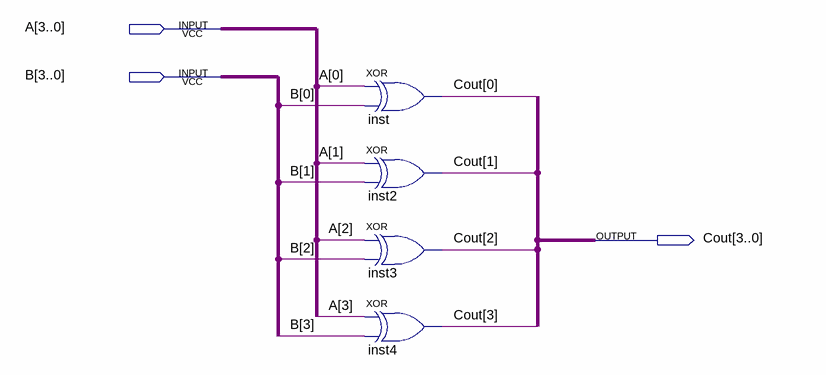
[diagram p0: schematic sheet]
// Quartus schematic XOR4-DIAGRAMA.bdf as structural Verilog: 4 symbols, 3 pins
module \XOR4-DIAGRAMA  (
  input  [3:0] A,
  input  [3:0] B,
  output [3:0] Cout
);

  xor inst (Cout[0], A[0], B[0]);
  xor inst2 (Cout[1], A[1], B[1]);
  xor inst3 (Cout[2], A[2], B[2]);
  xor inst4 (Cout[3], A[3], B[3]);
endmodule
